# EAGLE schematic SAM3U4E-v0 (EAGLE 5.11)
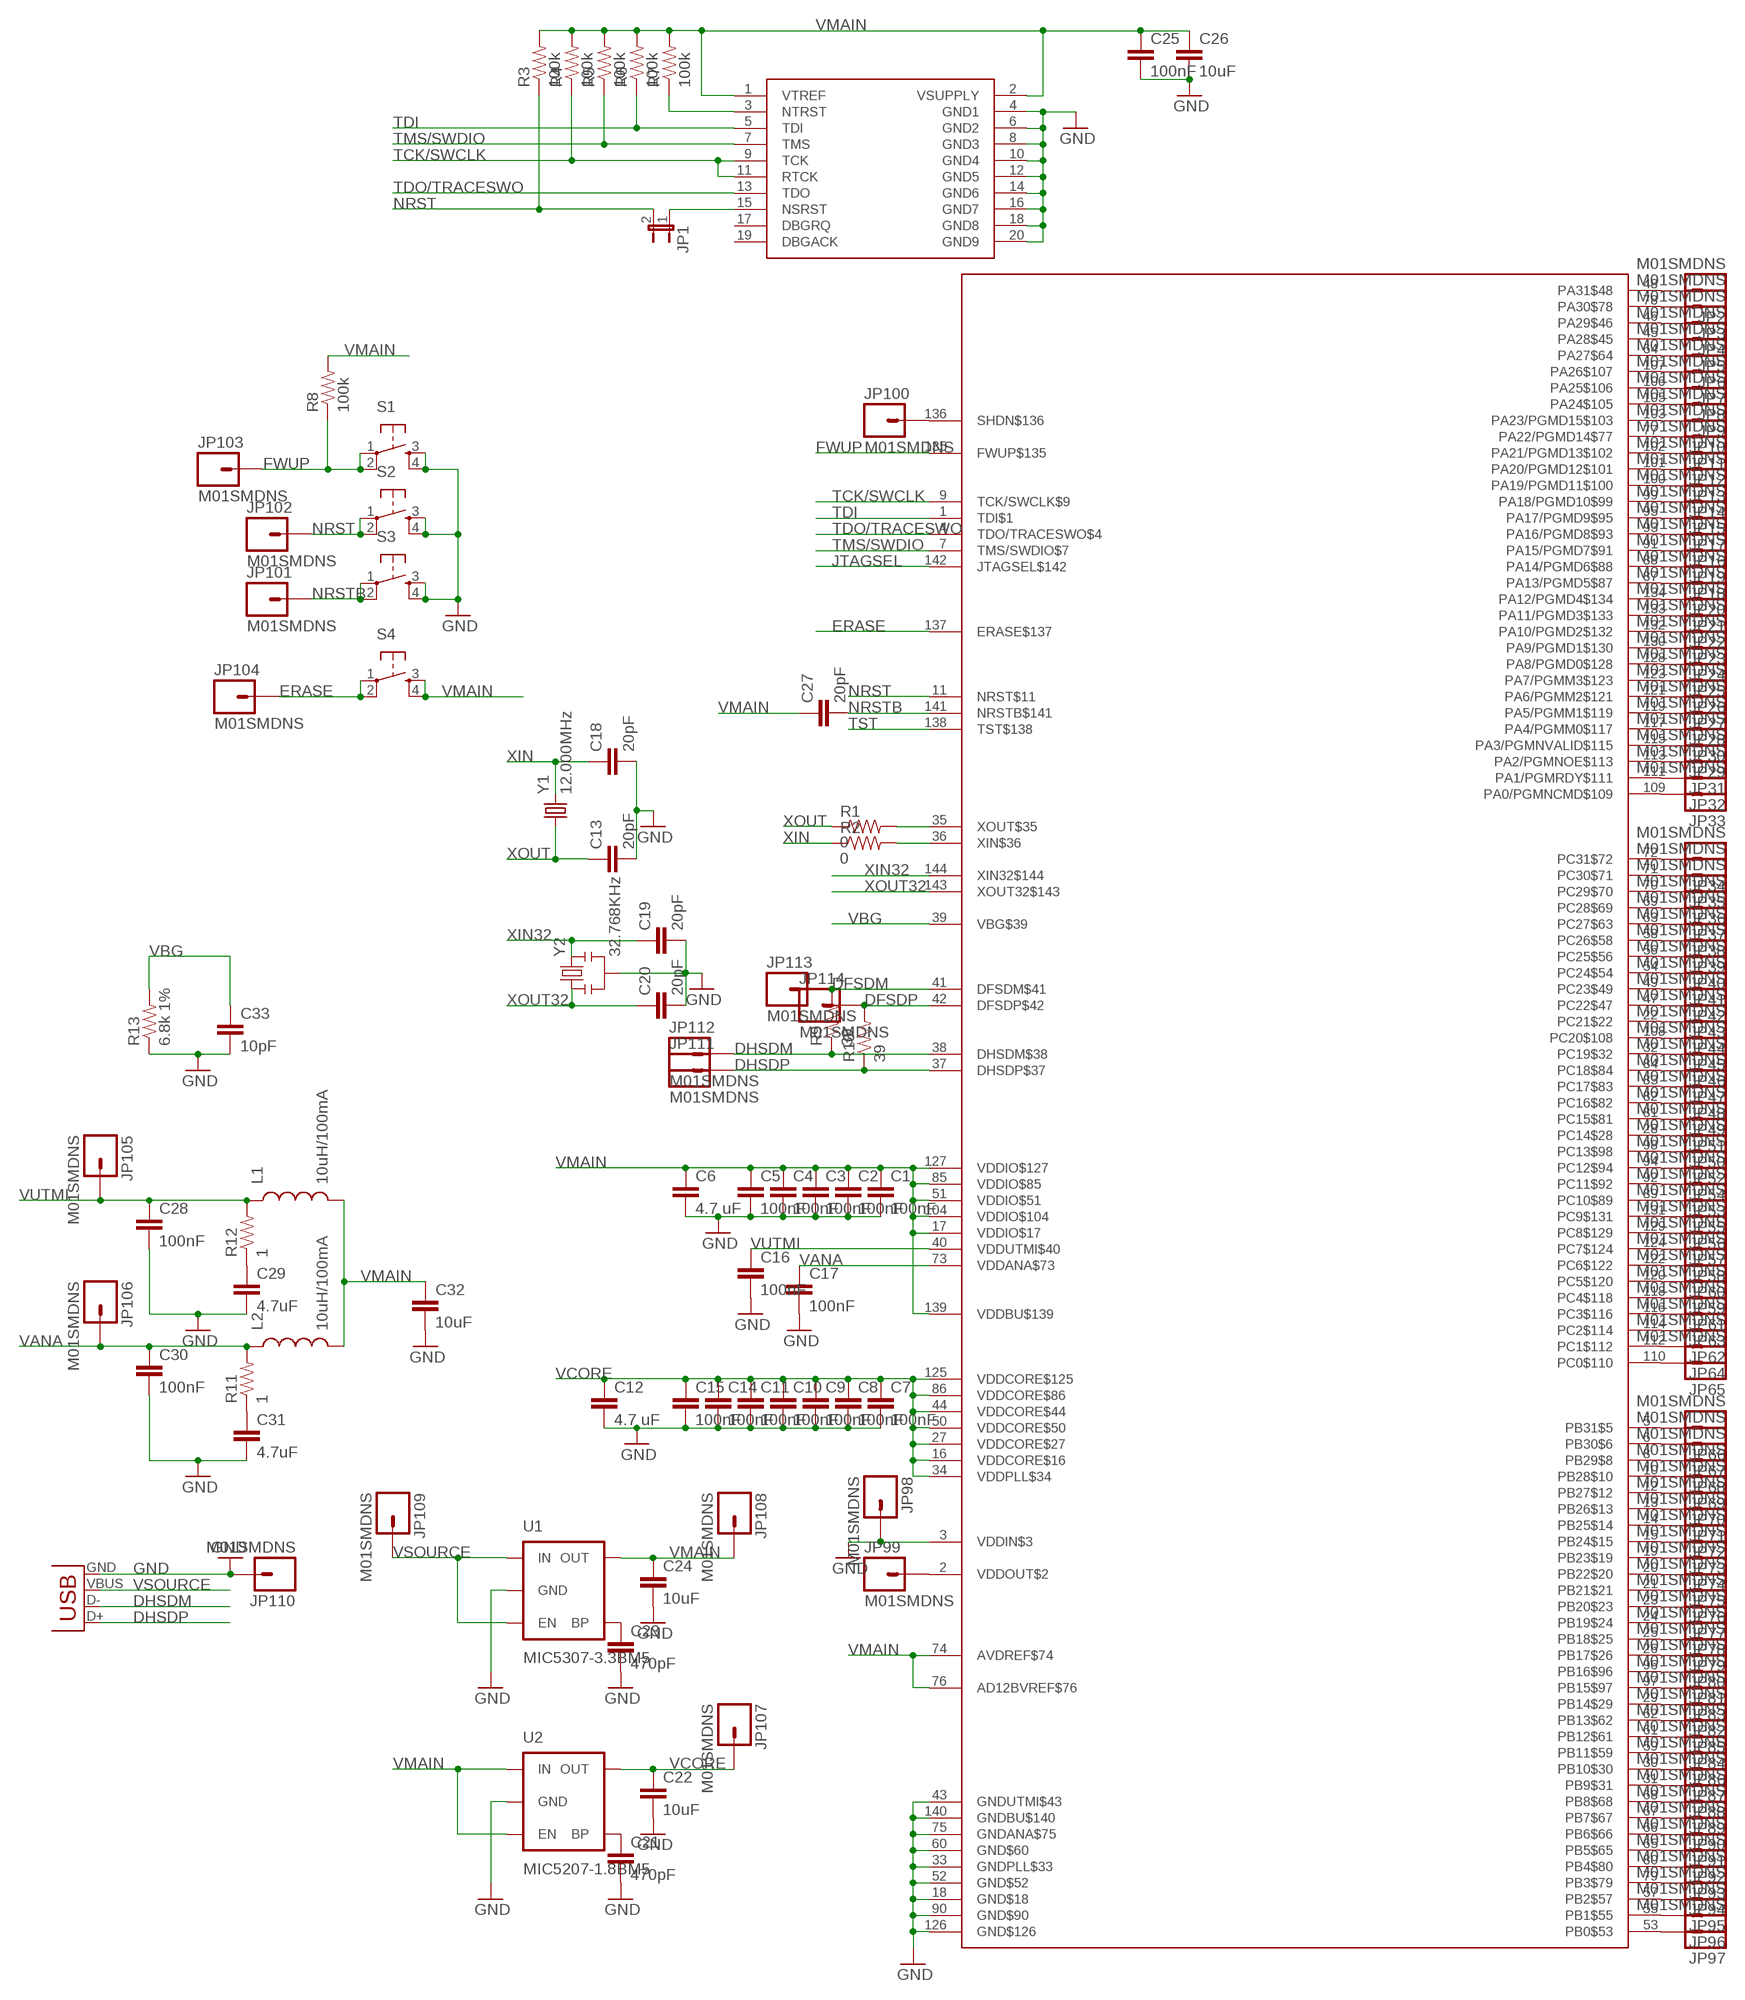
[diagram p0: schematic, sheet 1]

## Parts
C1  100nF  CAP0805  [0805]
C2  100nF  CAP0805  [0805]
C3  100nF  CAP0805  [0805]
C4  100nF  CAP0805  [0805]
C5  100nF  CAP0805  [0805]
C6  4.7 uF  CAP0805  [0805]
C7  100nF  CAP0805  [0805]
C8  100nF  CAP0805  [0805]
C9  100nF  CAP0805  [0805]
C10  100nF  CAP0805  [0805]
C11  100nF  CAP0805  [0805]
C12  4.7 uF  CAP0805  [0805]
C13  20pF  CAP0805  [0805]
C14  100nF  CAP0805  [0805]
C15  100nF  CAP0805  [0805]
C16  100nF  CAP0805  [0805]
C17  100nF  CAP0805  [0805]
C18  20pF  CAP0805  [0805]
C19  20pF  CAP0805  [0805]
C20  20pF  CAP0805  [0805]
C21  470pF  CAP0805  [0805]
C22  10uF  CAP0805  [0805]
C23  470pF  CAP0805  [0805]
C24  10uF  CAP0805  [0805]
C25  100nF  CAP0805  [0805]
C26  10uF  CAP0805  [0805]
C27  20pF  CAP0805  [0805]
C28  100nF  CAP0805  [0805]
C29  4.7uF  CAP0805  [0805]
C30  100nF  CAP0805  [0805]
C31  4.7uF  CAP0805  [0805]
C32  10uF  CAP0805  [0805]
C33  10pF  CAP0805  [0805]
JP1  JUMPER-2SMD-NC  [SJ_2S]
JP2  M01SMDNS  [1X01NS]
JP3  M01SMDNS  [1X01NS]
JP4  M01SMDNS  [1X01NS]
JP5  M01SMDNS  [1X01NS]
JP6  M01SMDNS  [1X01NS]
JP7  M01SMDNS  [1X01NS]
JP8  M01SMDNS  [1X01NS]
JP9  M01SMDNS  [1X01NS]
JP10  M01SMDNS  [1X01NS]
JP11  M01SMDNS  [1X01NS]
JP12  M01SMDNS  [1X01NS]
JP13  M01SMDNS  [1X01NS]
JP14  M01SMDNS  [1X01NS]
JP15  M01SMDNS  [1X01NS]
JP16  M01SMDNS  [1X01NS]
JP17  M01SMDNS  [1X01NS]
JP18  M01SMDNS  [1X01NS]
JP19  M01SMDNS  [1X01NS]
JP20  M01SMDNS  [1X01NS]
JP21  M01SMDNS  [1X01NS]
JP22  M01SMDNS  [1X01NS]
JP23  M01SMDNS  [1X01NS]
JP24  M01SMDNS  [1X01NS]
JP25  M01SMDNS  [1X01NS]
JP26  M01SMDNS  [1X01NS]
JP27  M01SMDNS  [1X01NS]
JP28  M01SMDNS  [1X01NS]
JP29  M01SMDNS  [1X01NS]
JP30  M01SMDNS  [1X01NS]
JP31  M01SMDNS  [1X01NS]
JP32  M01SMDNS  [1X01NS]
JP33  M01SMDNS  [1X01NS]
JP34  M01SMDNS  [1X01NS]
JP35  M01SMDNS  [1X01NS]
JP36  M01SMDNS  [1X01NS]
JP37  M01SMDNS  [1X01NS]
JP38  M01SMDNS  [1X01NS]
JP39  M01SMDNS  [1X01NS]
JP40  M01SMDNS  [1X01NS]
JP41  M01SMDNS  [1X01NS]
JP42  M01SMDNS  [1X01NS]
JP43  M01SMDNS  [1X01NS]
JP44  M01SMDNS  [1X01NS]
JP45  M01SMDNS  [1X01NS]
JP46  M01SMDNS  [1X01NS]
JP47  M01SMDNS  [1X01NS]
JP48  M01SMDNS  [1X01NS]
JP49  M01SMDNS  [1X01NS]
JP50  M01SMDNS  [1X01NS]
JP51  M01SMDNS  [1X01NS]
JP52  M01SMDNS  [1X01NS]
JP53  M01SMDNS  [1X01NS]
JP54  M01SMDNS  [1X01NS]
JP55  M01SMDNS  [1X01NS]
JP56  M01SMDNS  [1X01NS]
JP57  M01SMDNS  [1X01NS]
JP58  M01SMDNS  [1X01NS]
JP59  M01SMDNS  [1X01NS]
JP60  M01SMDNS  [1X01NS]
JP61  M01SMDNS  [1X01NS]
JP62  M01SMDNS  [1X01NS]
JP63  M01SMDNS  [1X01NS]
JP64  M01SMDNS  [1X01NS]
JP65  M01SMDNS  [1X01NS]
JP66  M01SMDNS  [1X01NS]
JP67  M01SMDNS  [1X01NS]
JP68  M01SMDNS  [1X01NS]
JP69  M01SMDNS  [1X01NS]
JP70  M01SMDNS  [1X01NS]
JP71  M01SMDNS  [1X01NS]
JP72  M01SMDNS  [1X01NS]
JP73  M01SMDNS  [1X01NS]
JP74  M01SMDNS  [1X01NS]
JP75  M01SMDNS  [1X01NS]
JP76  M01SMDNS  [1X01NS]
JP77  M01SMDNS  [1X01NS]
JP78  M01SMDNS  [1X01NS]
JP79  M01SMDNS  [1X01NS]
JP80  M01SMDNS  [1X01NS]
JP81  M01SMDNS  [1X01NS]
JP82  M01SMDNS  [1X01NS]
JP83  M01SMDNS  [1X01NS]
JP84  M01SMDNS  [1X01NS]
JP85  M01SMDNS  [1X01NS]
JP86  M01SMDNS  [1X01NS]
JP87  M01SMDNS  [1X01NS]
JP88  M01SMDNS  [1X01NS]
JP89  M01SMDNS  [1X01NS]
JP90  M01SMDNS  [1X01NS]
JP91  M01SMDNS  [1X01NS]
JP92  M01SMDNS  [1X01NS]
JP93  M01SMDNS  [1X01NS]
JP94  M01SMDNS  [1X01NS]
JP95  M01SMDNS  [1X01NS]
JP96  M01SMDNS  [1X01NS]
JP97  M01SMDNS  [1X01NS]
JP98  M01SMDNS  [1X01NS]
JP99  M01SMDNS  [1X01NS]
JP100  M01SMDNS  [1X01NS]
JP101  M01SMDNS  [1X01NS]
JP102  M01SMDNS  [1X01NS]
JP103  M01SMDNS  [1X01NS]
JP104  M01SMDNS  [1X01NS]
JP105  M01SMDNS  [1X01NS]
JP106  M01SMDNS  [1X01NS]
JP107  M01SMDNS  [1X01NS]
JP108  M01SMDNS  [1X01NS]
JP109  M01SMDNS  [1X01NS]
JP110  M01SMDNS  [1X01NS]
JP111  M01SMDNS  [1X01NS]
JP112  M01SMDNS  [1X01NS]
JP113  M01SMDNS  [1X01NS]
JP114  M01SMDNS  [1X01NS]
L1  10uH/100mA  INDUCTOR0805  [0805]
L2  10uH/100mA  INDUCTOR0805  [0805]
R1  0  RESISTOR0603-RES  [0603-RES]
R2  0  RESISTOR0603-RES  [0603-RES]
R3  100k  RESISTOR0603-RES  [0603-RES]
R4  100k  RESISTOR0603-RES  [0603-RES]
R5  100k  RESISTOR0603-RES  [0603-RES]
R6  100k  RESISTOR0603-RES  [0603-RES]
R7  100k  RESISTOR0603-RES  [0603-RES]
R8  100k  RESISTOR0603-RES  [0603-RES]
R9  39  RESISTOR0603-RES  [0603-RES]
R10  39  RESISTOR0603-RES  [0603-RES]
R11  1  RESISTOR0603-RES  [0603-RES]
R12  1  RESISTOR0603-RES  [0603-RES]
R13  6.8k 1%  RESISTOR0603-RES  [0603-RES]
S1  TAC_SWITCHSMD  [TACTILE_SWITCH_SMD]
S2  TAC_SWITCHSMD  [TACTILE_SWITCH_SMD]
S3  TAC_SWITCHSMD  [TACTILE_SWITCH_SMD]
S4  TAC_SWITCHSMD  [TACTILE_SWITCH_SMD]
U1  MIC5307-3.3BM5  V_REG_LDOSMD  [SOT23-5]
U2  MIC5207-1.8BM5  V_REG_LDOSMD  [SOT23-5]
U$1  ATSAM3U4E  [LQFP144]
U$2  ARM-JTAG-20  [2X10-SHROUDED]
X1  USB-SMD-NS  [USB-MINIB-NOSTOP]
Y1  12.000MHz  CRYSTAL5X3  [CRYSTAL-SMD-5X3]
Y2  32.768KHz  RESONATORSMD  [RESONATOR-SMD]

## Nets
DFSDM: JP113.1 R9.2 U$1.41(DFSDM$41)
DFSDP: JP114.1 R10.2 U$1.42(DFSDP$42)
DHSDM: JP112.1 R9.1 U$1.38(DHSDM$38) X1.D-
DHSDP: JP111.1 R10.1 U$1.37(DHSDP$37) X1.D+
ERASE: JP104.1 S4.1 S4.2 U$1.137(ERASE$137)
FWUP: JP103.1 R8.1 S1.1 S1.2 U$1.135(FWUP$135)
GND: C1.2 C2.2 C3.2 C4.2 C5.2 C6.2 C7.2 C8.2 C9.2 C10.2 C11.2 C12.2 C13.2 C14.2 C15.2 C16.2 C17.2 C18.2 C19.2 C20.2 C21.2 C22.2 C23.2 C24.2 C25.2 C26.2 C28.2 C29.2 C30.2 C31.2 C32.2 C33.2 JP98.1 JP110.1 R13.1 S1.3 S1.4 S2.3 S2.4 S3.3 S3.4 U1.2(GND) U2.2(GND) U$1.3(VDDIN$3) U$1.18(GND$18) U$1.33(GNDPLL$33) U$1.43(GNDUTMI$43) U$1.52(GND$52) U$1.60(GND$60) U$1.75(GNDANA$75) U$1.90(GND$90) U$1.126(GND$126) U$1.140(GNDBU$140) U$2.4(GND1) U$2.6(GND2) U$2.8(GND3) U$2.10(GND4) U$2.12(GND5) U$2.14(GND6) U$2.16(GND7) U$2.18(GND8) U$2.20(GND9) X1.GND Y2.2
JTAGSEL: U$1.142(JTAGSEL$142)
N$1: JP1.1 U$2.15(NSRST)
N$2: C31.1 R11.1
N$3: R1.2 U$1.35(XOUT$35)
N$4: R2.2 U$1.36(XIN$36)
N$5: C21.1 U2.4(BP)
N$6: C29.1 R12.1
N$8: JP2.1 U$1.48(PA31$48)
N$9: JP3.1 U$1.78(PA30$78)
N$10: R7.1 U$2.3(NTRST)
N$11: JP4.1 U$1.46(PA29$46)
N$12: C23.1 U1.4(BP)
N$13: JP5.1 U$1.45(PA28$45)
N$14: JP6.1 U$1.64(PA27$64)
N$15: JP7.1 U$1.107(PA26$107)
N$16: JP8.1 U$1.106(PA25$106)
N$17: JP9.1 U$1.105(PA24$105)
N$18: JP10.1 U$1.103(PA23/PGMD15$103)
N$19: JP11.1 U$1.77(PA22/PGMD14$77)
N$20: JP12.1 U$1.102(PA21/PGMD13$102)
N$21: JP13.1 U$1.101(PA20/PGMD12$101)
N$22: JP14.1 U$1.100(PA19/PGMD11$100)
N$23: JP15.1 U$1.99(PA18/PGMD10$99)
N$24: JP16.1 U$1.93(PA16/PGMD8$93)
N$25: JP17.1 U$1.95(PA17/PGMD9$95)
N$26: JP18.1 U$1.88(PA14/PGMD6$88)
N$27: JP19.1 U$1.91(PA15/PGMD7$91)
N$28: JP20.1 U$1.87(PA13/PGMD5$87)
N$29: JP21.1 U$1.134(PA12/PGMD4$134)
N$30: JP22.1 U$1.133(PA11/PGMD3$133)
N$31: JP23.1 U$1.132(PA10/PGMD2$132)
N$32: JP24.1 U$1.130(PA9/PGMD1$130)
N$33: JP25.1 U$1.128(PA8/PGMD0$128)
N$34: JP26.1 U$1.123(PA7/PGMM3$123)
N$35: JP27.1 U$1.121(PA6/PGMM2$121)
N$36: JP28.1 U$1.119(PA5/PGMM1$119)
N$37: JP29.1 U$1.115(PA3/PGMNVALID$115)
N$38: JP30.1 U$1.117(PA4/PGMM0$117)
N$39: JP31.1 U$1.113(PA2/PGMNOE$113)
N$40: JP32.1 U$1.111(PA1/PGMRDY$111)
N$41: JP33.1 U$1.109(PA0/PGMNCMD$109)
N$42: JP34.1 U$1.72(PC31$72)
N$43: JP35.1 U$1.71(PC30$71)
N$44: JP36.1 U$1.70(PC29$70)
N$45: JP37.1 U$1.69(PC28$69)
N$46: JP38.1 U$1.63(PC27$63)
N$47: JP39.1 U$1.58(PC26$58)
N$48: JP40.1 U$1.56(PC25$56)
N$49: JP41.1 U$1.54(PC24$54)
N$50: JP42.1 U$1.49(PC23$49)
N$51: JP43.1 U$1.47(PC22$47)
N$52: JP44.1 U$1.22(PC21$22)
N$53: JP45.1 U$1.108(PC20$108)
N$54: JP46.1 U$1.32(PC19$32)
N$55: JP47.1 U$1.84(PC18$84)
N$56: JP48.1 U$1.83(PC17$83)
N$57: JP49.1 U$1.82(PC16$82)
N$58: JP50.1 U$1.28(PC14$28)
N$59: JP51.1 U$1.81(PC15$81)
N$60: JP52.1 U$1.98(PC13$98)
N$61: JP53.1 U$1.92(PC11$92)
N$62: JP54.1 U$1.94(PC12$94)
N$63: JP55.1 U$1.89(PC10$89)
N$64: JP56.1 U$1.131(PC9$131)
N$65: JP57.1 U$1.129(PC8$129)
N$66: JP58.1 U$1.124(PC7$124)
N$67: JP59.1 U$1.120(PC5$120)
N$68: JP60.1 U$1.122(PC6$122)
N$69: JP61.1 U$1.118(PC4$118)
N$70: JP62.1 U$1.114(PC2$114)
N$71: JP63.1 U$1.116(PC3$116)
N$72: JP64.1 U$1.112(PC1$112)
N$73: JP65.1 U$1.110(PC0$110)
N$74: JP66.1 U$1.5(PB31$5)
N$75: JP67.1 U$1.6(PB30$6)
N$76: JP68.1 U$1.8(PB29$8)
N$77: JP69.1 U$1.10(PB28$10)
N$78: JP70.1 U$1.12(PB27$12)
N$79: JP71.1 U$1.13(PB26$13)
N$80: JP72.1 U$1.14(PB25$14)
N$81: JP73.1 U$1.15(PB24$15)
N$82: JP74.1 U$1.19(PB23$19)
N$83: JP75.1 U$1.20(PB22$20)
N$84: JP76.1 U$1.21(PB21$21)
N$85: JP77.1 U$1.23(PB20$23)
N$86: JP78.1 U$1.24(PB19$24)
N$87: JP79.1 U$1.25(PB18$25)
N$88: JP80.1 U$1.26(PB17$26)
N$89: JP81.1 U$1.96(PB16$96)
N$90: JP82.1 U$1.29(PB14$29)
N$91: JP83.1 U$1.97(PB15$97)
N$92: JP84.1 U$1.61(PB12$61)
N$93: JP85.1 U$1.62(PB13$62)
N$94: JP86.1 U$1.59(PB11$59)
N$95: JP87.1 U$1.30(PB10$30)
N$96: JP88.1 U$1.31(PB9$31)
N$97: JP89.1 U$1.68(PB8$68)
N$98: JP90.1 U$1.67(PB7$67)
N$99: JP91.1 U$1.66(PB6$66)
N$100: JP92.1 U$1.65(PB5$65)
N$101: JP93.1 U$1.80(PB4$80)
N$102: JP94.1 U$1.79(PB3$79)
N$103: JP95.1 U$1.57(PB2$57)
N$104: JP96.1 U$1.55(PB1$55)
N$105: JP97.1 U$1.53(PB0$53)
N$106: JP99.1 U$1.2(VDDOUT$2)
N$107: JP100.1 U$1.136(SHDN$136)
NRST: JP1.2 JP102.1 R3.1 S2.1 S2.2 U$1.11(NRST$11)
NRSTB: C27.2 JP101.1 S3.1 S3.2 U$1.141(NRSTB$141)
TCK/SWCLK: R4.1 U$1.9(TCK/SWCLK$9) U$2.9(TCK) U$2.11(RTCK)
TDI: R6.1 U$1.1(TDI$1) U$2.5(TDI)
TDO/TRACESWO: U$1.4(TDO/TRACESWO$4) U$2.13(TDO)
TMS/SWDIO: R5.1 U$1.7(TMS/SWDIO$7) U$2.7(TMS)
TST: U$1.138(TST$138)
VANA: C17.1 C30.1 JP106.1 L2.1 R11.2 U$1.73(VDDANA$73)
VBG: C33.1 R13.2 U$1.39(VBG$39)
VCORE: C7.1 C8.1 C9.1 C10.1 C11.1 C12.1 C14.1 C15.1 C22.1 JP107.1 U2.5(OUT) U$1.16(VDDCORE$16) U$1.27(VDDCORE$27) U$1.34(VDDPLL$34) U$1.44(VDDCORE$44) U$1.50(VDDCORE$50) U$1.86(VDDCORE$86) U$1.125(VDDCORE$125)
VMAIN: C1.1 C2.1 C3.1 C4.1 C5.1 C6.1 C24.1 C25.1 C26.1 C27.1 C32.1 JP108.1 L1.2 L2.2 R3.2 R4.2 R5.2 R6.2 R7.2 R8.2 S4.3 S4.4 U1.5(OUT) U2.1(IN) U2.3(EN) U$1.17(VDDIO$17) U$1.51(VDDIO$51) U$1.74(AVDREF$74) U$1.76(AD12BVREF$76) U$1.85(VDDIO$85) U$1.104(VDDIO$104) U$1.127(VDDIO$127) U$1.139(VDDBU$139) U$2.1(VTREF) U$2.2(VSUPPLY)
VSOURCE: JP109.1 U1.1(IN) U1.3(EN) X1.VBUS
VUTMI: C16.1 C28.1 JP105.1 L1.1 R12.2 U$1.40(VDDUTMI$40)
XIN: C18.1 R2.1 Y1.3
XIN32: C19.1 U$1.144(XIN32$144) Y2.3
XOUT: C13.1 R1.1 Y1.1
XOUT32: C20.1 U$1.143(XOUT32$143) Y2.1
Unconnected: U$2.17(DBGRQ) U$2.19(DBGACK)

## Library data of the parts
C1-C33 = SparkFun:CAP: Capacitor Standard 0603 ceramic capacitor, and 0.1" leaded capacitor.
JP1 = SparkFun:JUMPER-2: Jumper Basic 0.1" spaced jumper. Use with breakaway headers.
JP2-JP114 = SparkFun:M01: Header 1 Standard 1-pin 0.1" header. Use with straight break away headers (SKU : PRT-00116), right angle break away headers (PRT-00553), swiss pins (PRT-00743), machine pins (PRT-00117), and female headers (PRT-00115).
L1 L2 = SparkFun:INDUCTOR: Inductors Basic Inductor/Choke - 0603 and 1206. Footprints are not proven and vary greatly between part numbers.
R1-R13 = SparkFun:RESISTOR: Resistor Basic schematic elements and footprints for 0603, 1206, and PTH resistors.
S1-S4 = SparkFun:TAC_SWITCH: Momentary Switch Button commonly used for reset or general input. Spark Fun Electronics SKU : COM-00097
U1 U2 = SparkFun:V_REG_LDO: Voltage Regulator LDO Standard 150mA LDO voltage regulator in SOT-23 layout. Micrel part MIC5205. BP (by-pass) pin is used to lower output noise with 470pF cap.
U$1 = atmel-avr32:ATSAM3U4E
U$2 = atmel-avr32:ARM-JTAG-20
X1 = SparkFun:USB: USB Connectors USB-B-PTH is fully proven SKU : PRT-00139 USB-miniB is fully proven SKU : PRT-00587 USB-A-PCB is untested. USB-A-H is throughly reviewed, but untested. Spark Fun Electronics SKU : PRT-00437 USB-B-SMT is throughly reviewed, but untested. Needs silkscreen touching up. USB-A-S has not been used/tested USB-MB-H has not been used/tested
Y1 = SparkFun:CRYSTAL: Crystals Various standard crystals. Proven footprints. Spark Fun Electronics SKU : COM-00534
Y2 = SparkFun:RESONATOR: Resonator Small SMD resonator. This is the itty bitty 10/20MHz resonators with built in caps. CSTCE10M0G55 and CSTCE20M0V53. Footprint has been reviewed closely but hasn't been tested yet.